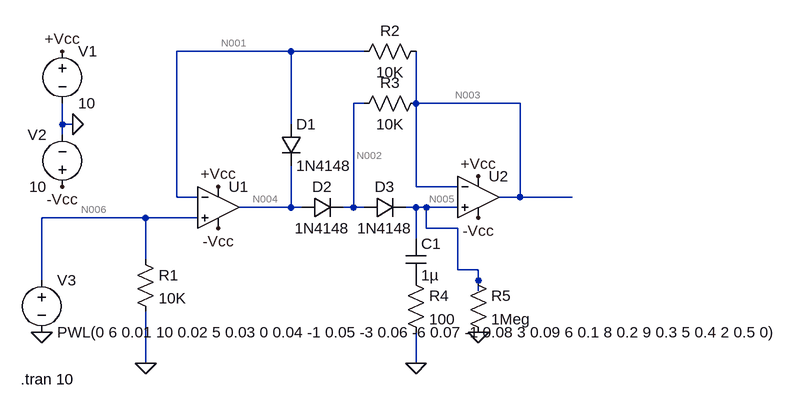
[diagram p0: schematic peak.asc]
peak.asc, the LTspice schematic file:
Version 4
SHEET 1 1152 680
WIRE 304 -128 128 -128
WIRE 416 -128 304 -128
WIRE 416 -48 400 -48
WIRE 496 -48 496 -128
WIRE 656 -48 496 -48
WIRE -48 -16 -48 -48
WIRE -32 -16 -48 -16
WIRE 304 -16 304 -128
WIRE -48 0 -48 -16
WIRE 496 80 496 -48
WIRE 560 80 496 80
WIRE 128 96 128 -128
WIRE 160 96 128 96
WIRE 656 96 656 -48
WIRE 656 96 624 96
WIRE 736 96 656 96
WIRE 304 112 304 48
WIRE 304 112 224 112
WIRE 320 112 304 112
WIRE 400 112 400 -48
WIRE 400 112 384 112
WIRE 416 112 400 112
WIRE 496 112 480 112
WIRE 512 112 496 112
WIRE 560 112 512 112
WIRE 80 128 -80 128
WIRE 160 128 80 128
WIRE 512 144 512 112
WIRE 560 144 512 144
WIRE 496 160 496 112
WIRE 80 192 80 128
WIRE 560 208 560 144
WIRE 592 208 560 208
WIRE -80 224 -80 128
WIRE 592 224 592 208
WIRE 592 240 592 224
WIRE 80 352 80 272
WIRE 496 352 496 304
FLAG 80 352 0
FLAG 496 352 0
FLAG -80 304 0
FLAG -32 -16 0
FLAG -48 -128 +Vcc
FLAG -48 80 -Vcc
FLAG 192 80 +Vcc
FLAG 592 64 +Vcc
FLAG 192 144 -Vcc
FLAG 592 128 -Vcc
FLAG 592 304 0
SYMBOL res 64 176 R0
SYMATTR InstName R1
SYMATTR Value 10K
SYMATTR SpiceLine tol=1 pwr=0.1
SYMBOL diode 288 -16 R0
SYMATTR InstName D1
SYMATTR Value 1N4148
SYMBOL diode 320 128 R270
WINDOW 0 32 32 VTop 2
WINDOW 3 0 32 VBottom 2
SYMATTR InstName D2
SYMATTR Value 1N4148
SYMBOL diode 416 128 R270
WINDOW 0 32 32 VTop 2
WINDOW 3 0 32 VBottom 2
SYMATTR InstName D3
SYMATTR Value 1N4148
SYMBOL res 512 -144 R90
WINDOW 0 0 56 VBottom 2
WINDOW 3 32 56 VTop 2
SYMATTR InstName R2
SYMATTR Value 10K
SYMATTR SpiceLine tol=1 pwr=0.1
SYMBOL res 512 -64 R90
WINDOW 0 0 56 VBottom 2
WINDOW 3 32 56 VTop 2
SYMATTR InstName R3
SYMATTR Value 10K
SYMATTR SpiceLine tol=1 pwr=0.1
SYMBOL cap 480 160 R0
SYMATTR InstName C1
SYMATTR Value 1µ
SYMBOL res 480 208 R0
SYMATTR InstName R4
SYMATTR Value 100
SYMATTR SpiceLine tol=1 pwr=0.1
SYMBOL voltage -80 208 R0
WINDOW 123 0 0 Left 0
WINDOW 39 0 0 Left 0
SYMATTR InstName V3
SYMATTR Value PWL(0 6 0.01 10 0.02 5 0.03 0 0.04 -1 0.05 -3 0.06 -6 0.07 -1 0.08 3 0.09 6 0.1 8 0.2 9 0.3 5 0.4 2 0.5 0)
SYMBOL voltage -48 -144 R0
WINDOW 123 0 0 Left 0
WINDOW 39 0 0 Left 0
SYMATTR InstName V1
SYMATTR Value 10
SYMBOL voltage -48 96 R180
WINDOW 0 24 96 Left 2
WINDOW 3 24 16 Left 2
WINDOW 123 0 0 Left 0
WINDOW 39 0 0 Left 0
SYMATTR InstName V2
SYMATTR Value 10
SYMBOL res 576 208 R0
SYMATTR InstName R5
SYMATTR Value 1Meg
SYMATTR SpiceLine tol=1 pwr=0.1
SYMBOL OpAmps\\UniversalOpAmp 592 96 R0
SYMATTR InstName U2
SYMBOL OpAmps\\UniversalOpAmp 192 112 R0
SYMATTR InstName U1
TEXT -112 376 Left 2 !.tran 10

The netlist it stands for:
* peak.asc
R1 N006 0 10K tol=1 pwr=0.1
D1 N001 N004 1N4148
D2 N004 N002 1N4148
D3 N002 N005 1N4148
R2 N003 N001 10K tol=1 pwr=0.1
R3 N003 N002 10K tol=1 pwr=0.1
C1 N005 P001 1µ
R4 P001 0 100 tol=1 pwr=0.1
V3 N006 0 PWL(0 6 0.01 10 0.02 5 0.03 0 0.04 -1 0.05 -3 0.06 -6 0.07 -1 0.08 3 0.09 6 0.1 8 0.2 9 0.3 5 0.4 2 0.5 0)
V1 +Vcc 0 10
V2 -Vcc 0 10
R5 N005 0 1Meg tol=1 pwr=0.1
XU2 N005 N003 +Vcc -Vcc N003 level1 Avol=1Meg GBW=10Meg Vos=0 En=0 Enk=0 In=0 Ink=0 Rin=500Meg  ; pins In+ In- V+ V- OUT
XU1 N006 N001 +Vcc -Vcc N004 level1 Avol=1Meg GBW=10Meg Vos=0 En=0 Enk=0 In=0 Ink=0 Rin=500Meg  ; pins In+ In- V+ V- OUT
.model D D
.lib standard.dio
.tran 10
.lib UniversalOpAmp1.lib
.backanno
.end

* Results of the author's LTspice run, read from the files saved beside the schematic
* Operating Point, zero values left out:
*   V(n006) = 6 V
*   V(n001) = 6 V
*   V(n004) = 6.792 V
*   V(n002) = 6.352 V
*   V(n005) = 6 V
*   V(n003) = 6 V
*   V(+vcc) = 10 V
*   V(-vcc) = 10 V
*   I(D3) = 5.992 µA
*   I(D2) = 41.23 µA
*   I(D1) = -2.521 nA
*   I(R5) = 6 µA
*   I(R3) = -35.23 µA
*   I(R2) = -10.52 nA
*   I(R1) = 600 µA
*   I(V2) = -16 nA
*   I(V1) = -16 nA
*   I(V3) = -600 µA
*   Ix(u2:1) = -8 nA
*   Ix(u2:2) = -8 nA
*   Ix(u2:3) = 8 nA
*   Ix(u2:4) = 8 nA
*   Ix(u2:5) = 35.26 µA
*   Ix(u1:1) = -8 nA
*   Ix(u1:2) = -8 nA
*   Ix(u1:3) = 8 nA
*   Ix(u1:4) = 8 nA
*   Ix(u1:5) = -41.22 µA
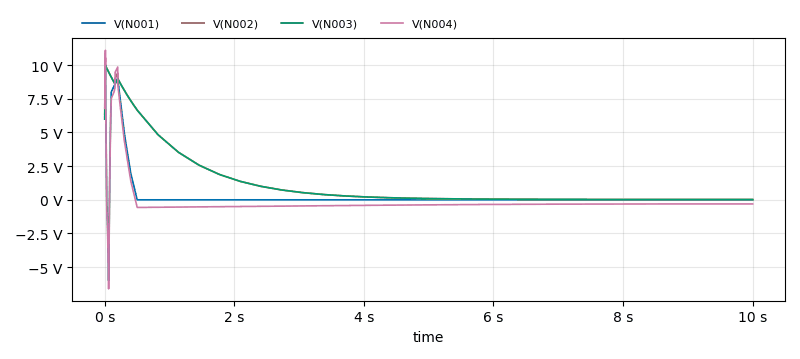
[diagram p1: Transient Analysis of peak.asc, plotted from the saved traces]
* Transient Analysis, 1 run:
*   V(N001): min -6 V, max 10 V, average 220 mV, rms 1.273 V, last 0 V
*   V(N002): min 20.42 mV, max 10.54 V, average 1.106 V, rms 2.416 V, last 20.42 mV
*   V(N003): min 20.45 mV, max 10 V, average 1.103 V, rms 2.408 V, last 20.45 mV
*   V(N004): min -6.605 V, max 11.09 V, average -170.2 mV, rms 1.304 V, last -304.1 mV